# EAGLE design dc_dc (EAGLE 9.6.2)
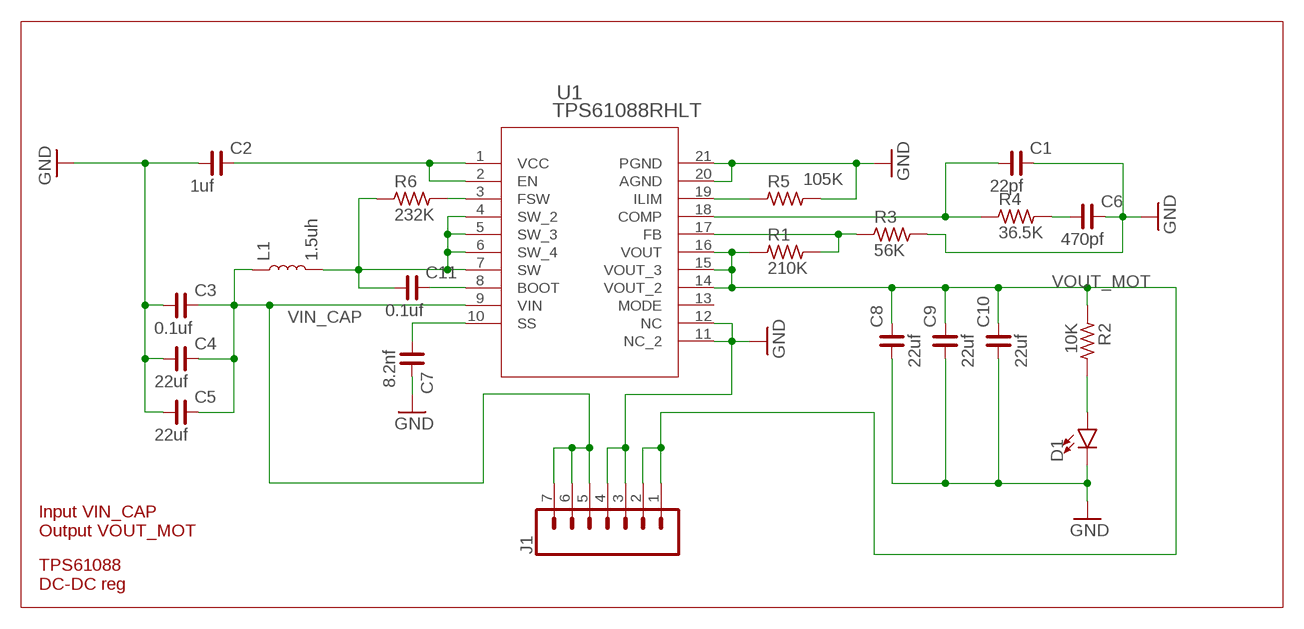
[diagram p0: schematic, sheet 1]

## Parts
C1  22pf  C_0603  [C0603]
C2  1uf  C_0603  [C0603]
C3  0.1uf  C_0603  [C0603]
C4  22uf  C_1210  [C1210]
C5  22uf  C_1210  [C1210]
C6  470pf  C_0603  [C0603]
C7  8.2nf  C_0603  [C0603]
C8  22uf  C_1210  [C1210]
C9  22uf  C_1210  [C1210]
C10  22uf  C_1210  [C1210]
C11  0.1uf  C_0603  [C0603]
D1  LED0603  [LED-0603]
J1  CONN_07LONGPADS  [1X07_LONGPADS]
L1  1.5uh  INDUCTOR-CR75-68UH  [CR75]
R1  210K  R_0603  [R0603]
R2  10K  R_0603  [R0603]
R3  56K  R_0603  [R0603]
R4  36.5K  R_0603  [R0603]
R5  105K  R_0603  [R0603]
R6  232K  R_0603  [R0603]
U1  TPS61088RHLT  [RHL0020A_TEX]

## Nets
GND: C1.2 C2.1 C3.1 C4.1 C5.1 C6.2 C7.2 C8.1 C9.1 C10.1 D1.C J1.3 J1.4 R3.2 R5.2 U1.11(NC_2) U1.12(NC) U1.20(AGND) U1.21(PGND)
N$1: C7.1 U1.10(SS)
N$2: R5.1 U1.19(ILIM)
N$3: C1.1 R4.1 U1.18(COMP)
N$4: C6.1 R4.2
N$5: C2.2 U1.1(VCC) U1.2(EN)
N$8: R1.2 R3.1 U1.17(FB)
N$9: D1.A R2.2
N$10: C11.2 U1.8(BOOT)
N$11: C11.1 L1.P$2 R6.1 U1.4(SW_2) U1.5(SW_3) U1.6(SW_4) U1.7(SW)
N$12: R6.2 U1.3(FSW)
VIN_CAP: C3.2 C4.2 C5.2 J1.5 J1.6 J1.7 L1.P$1 U1.9(VIN)
VOUT_MOT: C8.2 C9.2 C10.2 J1.1 J1.2 R1.1 R2.1 U1.14(VOUT_2) U1.15(VOUT_3) U1.16(VOUT)
Unconnected: U1.13(MODE)

## Notes on the sheet
- Input VIN_CAP
  Output VOUT_MOT
- TPS61088
  DC-DC reg

## Library data of the parts
C1-C11 = rc-master-smd:C_: NON-POLARIZED CAP
D1 = SparkFun-LED:LED: LED (Generic) Standard schematic elements and footprints for 5mm, 3mm, 1206, and 0603 sized LEDs. Generic LEDs with no color specified.
J1 = SparkFun-Connectors:CONN_07: Multi connection point. Often used as Generic Header-pin footprint for 0.1 inch spaced/style header connections On any of the 0.1 inch spaced packages, you can populate with these: Break Away Headers - Straight <https://www.sparkfun.com/products/116> (PRT-00116) Break Away Male Headers - Right Angle <https://www.sparkfun.com/products/553> (PRT-00553) Female Headers <https://www.sparkfun.com/products/115> (PRT-00115) Break Away Headers - Machine Pin <https://www.sparkfun.com/products/117> (PRT-00117) Break Away Female Headers - Swiss Machine Pin <https://www.sparkfun.com/products/743> (PRT-00743) For SCREWTERMINALS and SPRING TERMINALS visit here: Screw Terimnals on SparkFun.com <https://www.sparkfun.com/search/results?term=Screw+Terminals> (5mm/3.5mm/2.54mm spacing) This device is also useful as a general connection point to wire up your design to another part of your project. Our various solder wires solder well into these plated through hole pads. Hook-Up Wire - Assortment (Stranded, 22 AWG) <https://www.sparkfun.com/products/11375> (PRT-11375) Hook-Up Wire - Assortment (Solid Core, 22 AWG) <https://www.sparkfun.com/products/11367> (PRT-11367) View the entire wire category on our website here <https://www.sparkfun.com/categories/141> Special notes: Molex polarized connector foot print use with SKU : PRT-08231 with associated crimp pins and housings. 1MM SMD Version SKU: PRT-10208 NOTES ON THE VARIANTS LOCK and LOCK_LONGPADS... This footprint was designed to help hold the alignment of a through-hole component (i.e. 6-pin header) while soldering it into place. You may notice that each hole has been shifted either up or down by 0.005 of an inch from it's more standard position (which is a perfectly straight line). This slight alteration caused the pins (the squares in the middle) to touch the edges of the holes. Because they are alternating, it causes a "brace" to hold the component in place. 0.005 has proven to be the perfect amount of "off-center" position when using our standard breakaway headers. Although looks a little odd when you look at the bare footprint, once you have a header in there, the alteration is very hard to notice. Also,if you push a header all the way into place, it is covered up entirely on the bottom side.
L1 = SparkFun-Coils:INDUCTOR: Inductors Resist changes in electrical current. Basically a coil of wire. SparkFun Products: SparkFun Load Cell Amplifier - HX711 <https://www.sparkfun.com/products/13879> IOIO-OTG - V2.2 <https://www.sparkfun.com/products/13613>; PROD_ID: NDUC-09739; VALUE: 68µH/±20%/1.05A
R1-R6 = rc-master-smd:R_: RESISTOR
U1 = TPS61088:TPS61088RHLT: TPS61088; BUILT_BY: EMA_UL_Team; COPYRIGHT: Copyright (C) 2018 Accelerated Designs. All rights reserved; MANUFACTURER_PART_NUMBER: TPS61088RHLT; SOURCELIBRARY: TI_2019-03-28; VENDOR: Texas Instruments

## Board
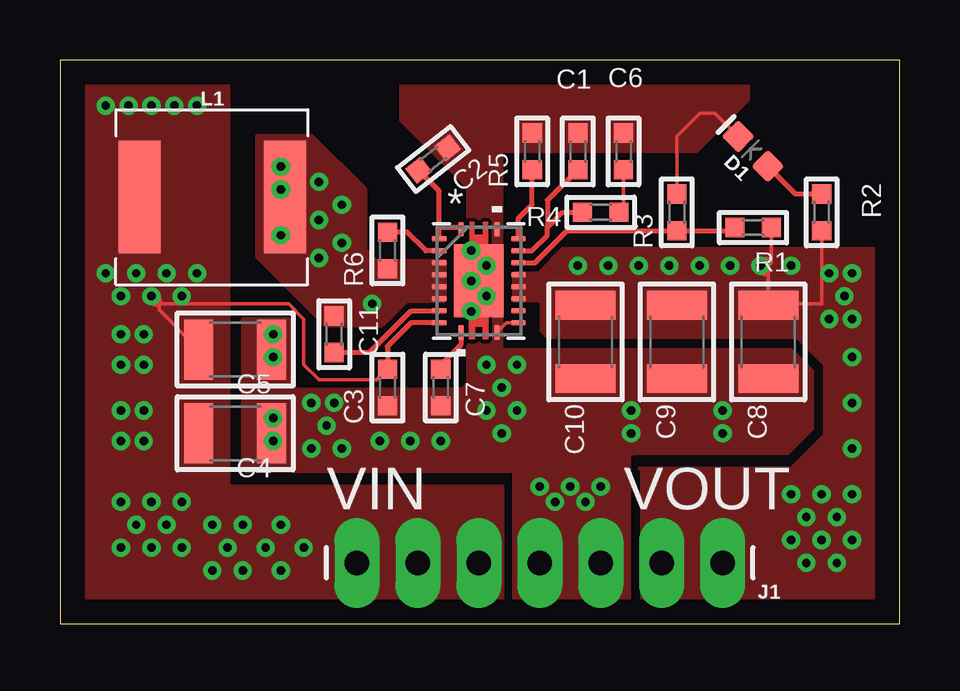
[diagram p1: board, top side]
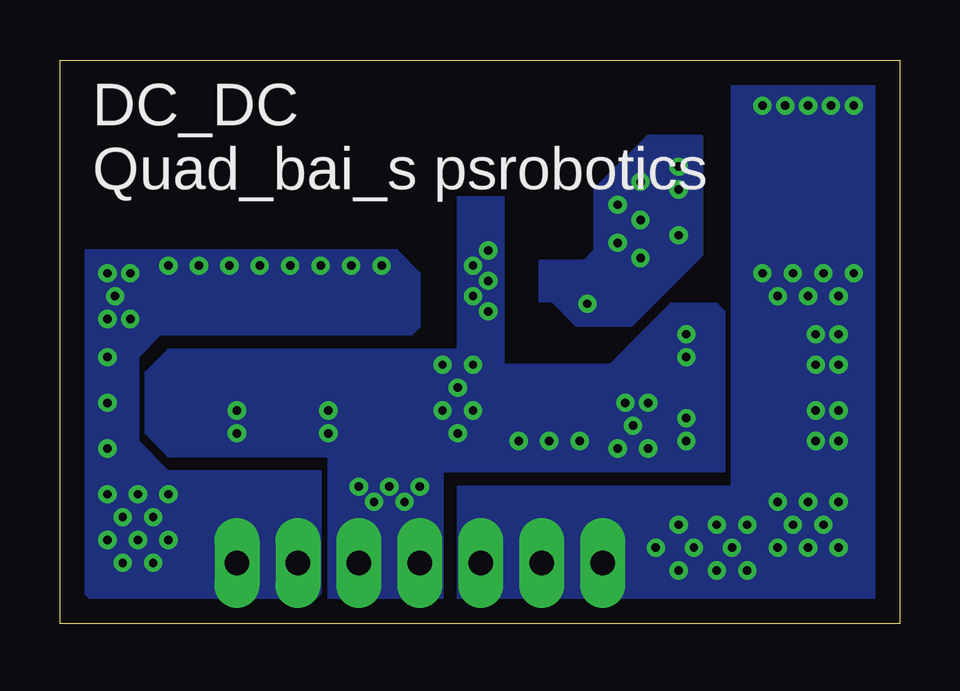
[diagram p2: board, bottom side, seen from below]

Size 35 x 23.49 mm. Coordinates in mm from the lower left corner, seen from the top.
Outline: 0,0 35,0 35,23.49 0,23.49 0,0
Copper layers (1*16): Top 0.035mm / dielectric 1.5mm / Bottom 0.035mm
Design rules "default": minimum track width 6mil, minimum drill 0.35mm, track to track 6mil, track to pad 6mil, pad to pad 6mil, via to via 6mil, smd to smd 6mil, copper to edge 40mil, drill to drill 6mil, minimum pad ring 10mil, minimum via ring 8mil, stop-mask expansion 4mil, vias tented up to drill 0mil, thermal gap 10mil

### Footprints (pad centres in the part's own frame; a part is rotated, then mirrored left to right if it is on the bottom)
C0603 = smd 0.8 x 0.8: 1 -0.762,0; 2 0.762,0
C1210 = smd 1.2 x 2.5: 1 -1.524,0; 2 1.524,0
LED-0603 = smd 1 x 1: A -0.877,0; C 0.877,0
1X07_LONGPADS = drill 1.016 pad 1.88 long: 1 0,0; 2 2.54,0; 3 5.08,0; 4 7.62,0; 5 10.16,0; 6 12.7,0; 7 15.24,0
CR75 = smd 1.75 x 4.7: P$1 -3.025,0; P$2 3.025,0
R0603 = smd 0.8 x 0.8: 1 -0.762,0; 2 0.762,0
RHL0020A_TEX = smd 0.229 x 0.61: 1 -0.75,2.15; 10 -0.75,-2.15; 11 0.75,-2.15; 20 0.75,2.15 | smd 0.61 x 0.229: 2 -1.65,1.75; 3 -1.65,1.25; 4 -1.65,0.75; 5 -1.65,0.25; 6 -1.65,-0.25; 7 -1.65,-0.75; 8 -1.65,-1.25; 9 -1.65,-1.75; 12 1.65,-1.75; 13 1.65,-1.25; 14 1.65,-0.75; 15 1.65,-0.25; 16 1.65,0.25; 17 1.65,0.75; 18 1.65,1.25; 19 1.65,1.75 | smd 2.057 x 3.048: 21 0,0

### Placement (x,y rotation side)
C1  21.59,19.68 90 top
C2  15.56,19.37 217.8 top
C3  13.65,9.84 90 top
C4  7.3,7.94 180 top
C5  7.3,11.43 180 top
C6  23.5,19.68 90 top
C7  15.88,9.84 270 top
C8  29.53,11.75 90 top
C9  25.72,11.75 90 top
C10  21.91,11.75 90 top
C11  11.43,12.06 270 top
D1  28.89,19.68 135 top
J1  27.62,2.54 180 top
L1  6.35,17.78 0 top
R1  28.89,16.51 180 top
R2  31.75,17.14 90 top
R3  25.72,17.14 90 top
R4  22.54,17.14 0 top
R5  19.68,19.68 90 top
R6  13.65,15.56 90 top
U1  17.46,14.29 0 top

### Tracks (layer width: path | path; a pad name or v marks a point on that pad's centre or on a via)
GND  (via drill 0.35)
  Top 0.152: R3.2 25.72,20.32 26.67,21.27 27.3,21.27 D1.C | U1.12 18.61,12.54 U1.11
  other vias: 17.14,15.56 17.78,14.92 17.14,14.29 17.78,13.65 17.14,13.02 10.48,9.21 11.43,9.21 11.11,8.26 10.48,7.3 11.75,7.3 13.34,7.62 14.61,7.62 15.88,7.62 17.78,10.79 19.05,10.79 18.41,9.84 17.78,8.89 19.05,8.89 18.41,7.94 23.81,8.89 23.81,7.94 27.62,8.89 27.62,7.94 20,5.71 21.27,5.71 22.54,5.71 20.64,5.08 21.91,5.08 8.89,12.06 8.89,11.11 8.89,8.57 8.89,7.62
  pour Top (no thermals): 7.62,12.7 7.62,6.48 7.75,6.35 18.92,6.35 18.92,0.25 23.62,0.25 23.75,0.38 23.75,6.99 23.88,7.11 30.35,7.11 31.37,8.13 31.37,10.54 30.48,11.43 18.41,11.43 18.41,19.68 26.54,19.68 28.7,21.84 28.7,23.11 14.61,23.11 14.22,22.73 14.22,20.95 17.02,18.16 17.02,15.75 16.51,15.75 16.51,12.83 17.14,12.83 17.14,10.16 16.76,9.78 9.59,9.78 9.59,12.7
  pour Top (no thermals): 17.02,17.4 17.02,9.65 17.14,9.53 18.41,9.53 18.41,17.46 17.14,17.46 17.08,17.46
  pour Bottom (no thermals): 16.51,17.78 16.51,10.79 12.06,10.79 9.53,13.34 7.62,13.34 7.3,13.02 7.3,6.35 19.05,6.35 19.05,0.32 23.81,0.32 23.81,6.99 30.48,6.99 31.43,7.94 31.43,10.48 30.48,11.43 18.41,11.43 18.41,17.78
N$1
  Top 0.203: U1.10 16.71,11.63 15.88,10.79 C7.1
N$2
  Top 0.203: U1.19 19.11,16.89 19.68,17.46 R5.1
N$3
  Top 0.203: U1.18 19.66,15.54 20.32,16.19 20.32,16.51 | 20.32,16.51 20.95,17.14 R4.1 | C1.1 20.32,17.65 20.32,16.51
N$4
  Top 0.152: C6.1 23.5,17.34 R4.2
N$5
  Top 0.203: U1.2 15.81,16.51 | 15.81,16.51 15.81,18.04 C2.2 | U1.1 16.64,16.51 15.81,16.51
N$8
  Top 0.203: U1.17 19.8,15.04 21.14,16.38 R3.1 28,16.38 R1.2
N$9
  Top 0.203: R2.2 30.67,17.91 D1.A
N$10
  Top 0.203: U1.8 15.79,13.02 14.61,13.02 12.89,11.3 C11.2
N$11  (via drill 0.35)
  other vias: 9.21,19.05 10.79,18.41 10.79,16.83 10.79,15.24 9.21,18.1 9.21,16.19 11.75,15.88 11.75,17.46 13.02,13.34
  pour Top (no thermals): 8.26,20.32 10.48,20.32 12.7,18.1 12.7,15.56 13.14,15.11 16,15.11 16,13.46 14.41,13.46 13.4,12.45 11.11,12.45 8.26,15.3
  pour Bottom (no thermals): 8.26,20.32 10.48,20.32 12.7,18.1 12.7,15.56 13.14,15.11 14.99,15.11 14.99,13.46 14.48,13.46 13.46,12.45 11.18,12.45 8.26,15.37
N$12
  Top 0.203: U1.3 15.26,15.54 14.48,16.32 R6.2
VIN_CAP  (via drill 0.35)
  Top 0.152: C3.2 13.21,10.16 10.79,10.16 10.16,10.79 10.16,12.7 9.53,13.34 4.23,13.34 | 4.23,13.34 4.13,13.34 4.13,13.23 | 4.13,13.23 4.13,13.08 C5.2 | 4.23,13.34 4.1,13.74 v3.81,13.65 | 4.23,13.34 3.8,13.35 v3.81,13.65 | 4.13,13.23 4.11,13.66 v3.81,13.65 | 4.13,13.23 3.72,13.37 v3.81,13.65
  Top 0.203: U1.9 14.63,12.54 13.65,11.56 C3.2
  other vias: 1.91,21.59 2.86,21.59 3.81,21.59 4.76,21.59 5.71,21.59 1.91,14.61 3.17,14.61 4.45,14.61 5.71,14.61 2.54,13.65 5.08,13.65 2.54,12.06 3.49,12.06 2.54,10.79 3.49,10.79 2.54,8.89 3.49,8.89 2.54,7.62 3.49,7.62 2.54,5.08 3.81,5.08 5.08,5.08 3.17,4.13 4.45,4.13 2.54,3.17 3.81,3.17 5.08,3.17 6.35,4.13 7.62,4.13 6.99,3.17 6.35,2.22 7.62,2.22 8.57,3.17 9.21,4.13 9.21,2.22 10.16,3.17
  pour Top (no thermals): 0.64,22.86 6.99,22.86 6.99,5.71 18.41,5.71 18.41,0.32 0.64,0.32
  pour Bottom (no thermals): 1.27,22.86 6.99,22.86 6.99,5.71 18.41,5.71 18.41,0.32 0.95,0.32 0.95,22.86
VOUT_MOT  (via drill 0.35)
  Top 0.152: R1.1 29.65,15.2 | 29.65,15.2 29.65,15.05 29.53,14.92 29.53,14.5 | 29.53,14.5 29.53,13.34 | 29.53,13.34 C8.2 | R2.1 31.75,13.34 29.53,13.34 | 29.65,15.2 29.23,15.22 v29.21,14.92 | 29.65,15.2 29.49,14.81 v29.21,14.92 | 29.53,14.5 29.51,14.93 v29.21,14.92 | 29.53,14.5 29.12,14.63 v29.21,14.92
  other vias: 21.59,14.92 22.86,14.92 24.13,14.92 25.4,14.92 26.67,14.92 27.94,14.92 30.48,14.92 32.07,14.61 33.02,14.61 32.7,13.65 32.07,12.7 33.02,12.7 33.02,11.11 33.02,9.21 33.02,7.3 30.48,5.4 31.75,5.4 33.02,5.4 31.11,4.45 32.38,4.45 30.48,3.49 31.75,3.49 33.02,3.49 31.11,2.54 32.38,2.54
  pour Top (no thermals): 18.92,14.61 19.94,14.61 20.95,15.62 21.59,15.62 34.8,15.62 34.8,0.38 24.26,0.38 24.26,6.35 24.13,6.48 30.48,6.48 31.88,7.87 31.88,10.79 30.99,11.68 30.73,11.94 20.32,11.94 20.07,12.19 20.07,13.46 18.92,13.46
  pour Bottom (no thermals): 24.13,6.35 24.13,1.27 24.45,0.95 33.66,0.95 33.97,1.27 33.97,15.56 20.95,15.56 20,14.61 20,12.38 20.32,12.06 30.8,12.06 31.75,11.11 31.75,7.62 30.48,6.35

### Text on the board
tPlace: VIN | VOUT
bPlace: DC_DC / Quad_bai_s psrobotics